# EAGLE design untitled (EAGLE 9.5.1)
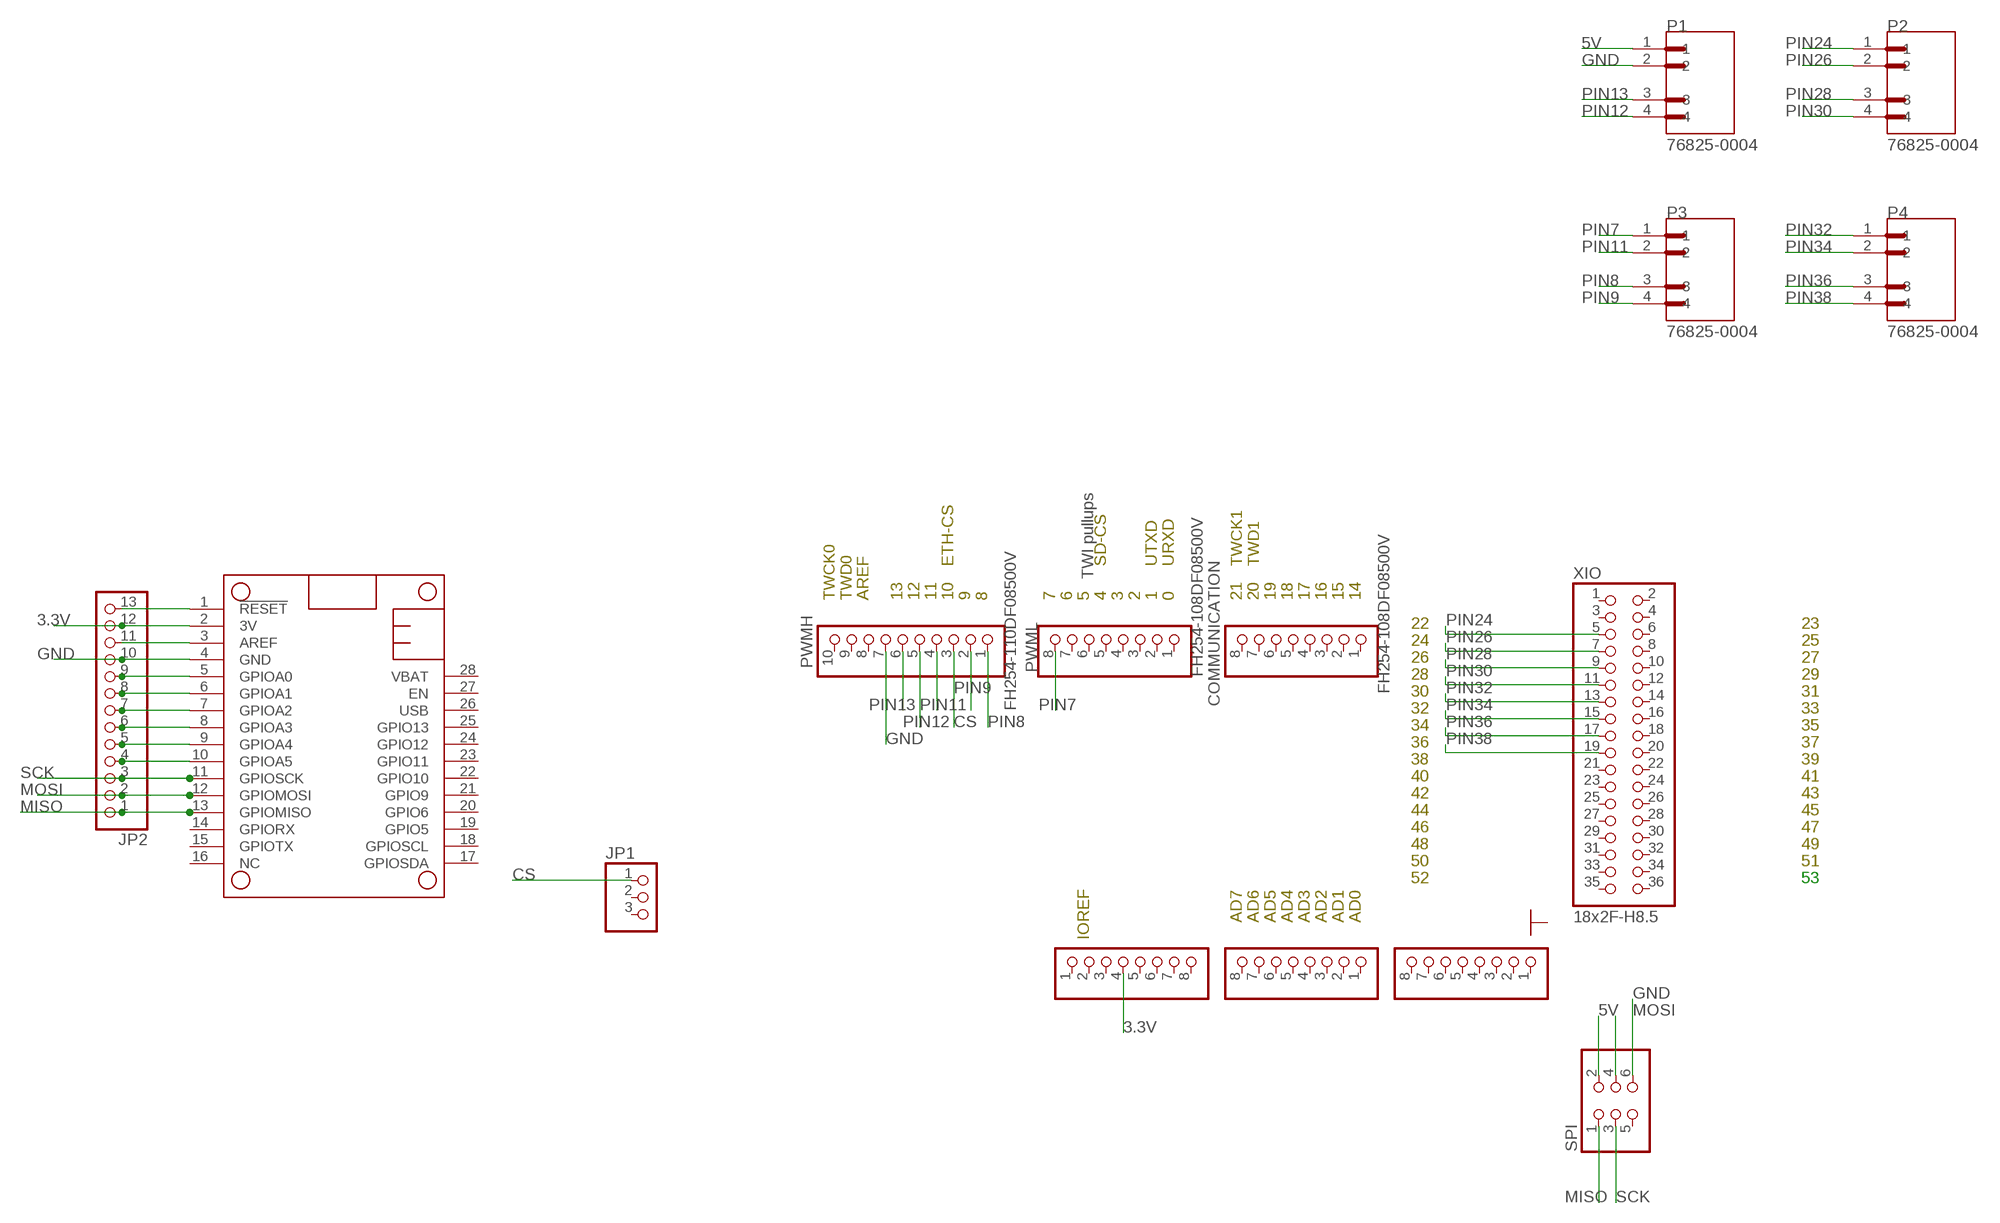
[diagram p0: schematic, sheet 1]

## Parts
ADCH  FH254-108DF08500V  1683_20TW-536  [1X08]
ADCL  FH254-108DF08500V  1683_20TW-536  [1X08]
COMMUNICATION  FH254-108DF08500V  1683_20TW-536  [1X08]
JP1  HEADER-1X376MIL  [1X03_ROUND_76]
JP2  HEADER-1X13  [1X13_ROUND_70]
MS1  FEATHERWING_NODIM  [FEATHERWING_NODIM]
P1  76825-0004  [MOLEX_76825-0004]
P2  76825-0004  [MOLEX_76825-0004]
P3  76825-0004  [MOLEX_76825-0004]
P4  76825-0004  [MOLEX_76825-0004]
POWER  FH254-108DF08500V  1683_20TW-536  [1X08]
PWMH  FH254-110DF08500V  1684_20TW-537  [1X10]
PWML  FH254-108DF08500V  1683_20TW-536  [1X08]
SPI  ICSP  0114_PH254-203DF118A00V  [2X03]
XIO  18x2F-H8.5  1756_12TW323  [2X18]

## Nets
3.3V: JP2.11 JP2.12 MS1.2(3V) MS1.3(AREF) POWER.4
5V: P1.1 SPI.2
CS: JP1.1 PWMH.3
GND: JP2.10 MS1.4(GND) P1.2 PWMH.7 SPI.6
MISO: JP2.1 MS1.13(GPIOMISO) SPI.1
MOSI: JP2.2 MS1.12(GPIOMOSI) SPI.4
N$22: JP2.13 MS1.1(!RESET)
N$28: JP2.4 MS1.10(GPIOA5)
N$29: JP2.5 MS1.9(GPIOA4)
N$30: JP2.6 MS1.8(GPIOA3)
N$31: JP2.7 MS1.7(GPIOA2)
N$32: JP2.8 MS1.6(GPIOA1)
N$33: JP2.9 MS1.5(GPIOA0)
PIN7: P3.1 PWML.8
PIN8: P3.3 PWMH.1
PIN9: P3.4 PWMH.2
PIN11: P3.2 PWMH.4
PIN12: P1.4 PWMH.5
PIN13: P1.3 PWMH.6
PIN24: P2.1 XIO.5
PIN26: P2.2 XIO.7
PIN28: P2.3 XIO.9
PIN30: P2.4 XIO.11
PIN32: P4.1 XIO.13
PIN34: P4.2 XIO.15
PIN36: P4.3 XIO.17
PIN38: P4.4 XIO.19
SCK: JP2.3 MS1.11(GPIOSCK) SPI.3
Unconnected: ADCH.1 ADCH.2 ADCH.3 ADCH.4 ADCH.5 ADCH.6 ADCH.7 ADCH.8 ADCL.1 ADCL.2 ADCL.3 ADCL.4 ADCL.5 ADCL.6 ADCL.7 ADCL.8 COMMUNICATION.1 COMMUNICATION.2 COMMUNICATION.3 COMMUNICATION.4 COMMUNICATION.5 COMMUNICATION.6 COMMUNICATION.7 COMMUNICATION.8 JP1.2 JP1.3 MS1.14(GPIORX) MS1.15(GPIOTX) MS1.16(NC) MS1.17(GPIOSDA) MS1.18(GPIOSCL) MS1.19(GPIO5) MS1.20(GPIO6) MS1.21(GPIO9) MS1.22(GPIO10) MS1.23(GPIO11) MS1.24(GPIO12) MS1.25(GPIO13) MS1.26(USB) MS1.27(EN) MS1.28(VBAT) POWER.1 POWER.2 POWER.3 POWER.5 POWER.6 POWER.7 POWER.8 PWMH.8 PWMH.9 PWMH.10 PWML.1 PWML.2 PWML.3 PWML.4 PWML.5 PWML.6 PWML.7 SPI.5 XIO.1 XIO.2 XIO.3 XIO.4 XIO.6 XIO.8 XIO.10 XIO.12 XIO.14 XIO.16 XIO.18 XIO.20 XIO.21 XIO.22 XIO.23 XIO.24 XIO.25 XIO.26 XIO.27 XIO.28 XIO.29 XIO.30 XIO.31 XIO.32 XIO.33 XIO.34 XIO.35 XIO.36

## Notes on the sheet
- ETH-CS | SD-CS | UTXD | URXD | TWCK1 | TWD1
- TWI pullups
- TWCK0 | TWD0 | AREF | 13 | 12 | 11 | 10 | 9 | 8 | 7 | 6 | 5 | 4 | 3 | 2 | 1 | 0 | 21 | 20 | 19 | 18 | 17 | 16 | 15 | 14
- 22 | 23
- 24 | 25
- 26 | 27
- 28 | 29
- 30 | 31
- 32 | 33
- 34 | 35
- 36 | 37
- 38 | 39
- 40 | 41
- 42 | 43
- 44 | 45
- 46 | 47
- 48 | 49
- 50 | 51
- 52 | 53
- AD7 | AD6 | AD5 | AD4 | AD3 | AD2 | AD1 | AD0
- IOREF

## Library data of the parts
ADCH ADCL COMMUNICATION POWER PWML = Connettori:1683_20TW-536: Female Gray Connector strip for Arduino 3V3 bases - 8x1 F V h 8,5 p2,54mm; MONTHLY_USAGE: _____; PART_NUMBER: 20TW-536; PRICE: _____; SUPPLIER: _____; TYPE: Connettori
JP1 = microbuilder:HEADER-1X3: PIN HEADER
JP2 = microbuilder:HEADER-1X13
MS1 = microbuilder:FEATHERWING
P1-P4 = 76825-0004:76825-0004: Conn Power HDR 4 POS 5.7mm Solder RA Thru-Hole 4 Terminal 1 Port Tray Mega-Fit; AVAILABILITY: Unavailable; DESCRIPTION: Connector Header Through Hole, Right Angle 4 position 0.224 _5.70mm_; MF: Molex; MP: 768250004; PACKAGE: None; PRICE: None
PWMH = Connettori:1684_20TW-537: Female Gray Connector strip for Arduino 3V3 bases - 10x1 F V h 8,5 p2,54mm; MONTHLY_USAGE: _____; PART_NUMBER: 20TW-537; PRICE: _____; SUPPLIER: _____; TYPE: Connettori
SPI = Connettori:0114_PH254-203DF118A00V: 3x2 M V h 8,5 mm p2,54; MONTHLY_USAGE: _____; PART_NUMBER: PH254-203DF118A00V; PRICE: _____; SUPPLIER: _____; TYPE: Connettori
XIO = Connettori:1756_12TW323: Female Gray Connector strip for Arduino 3V3 bases 18x2 F V h 8,5 p2,54; MONTHLY_USAGE: _____; PART_NUMBER: 12TW323; PRICE: _____; SUPPLIER: _____; TYPE: Connettori

## Board
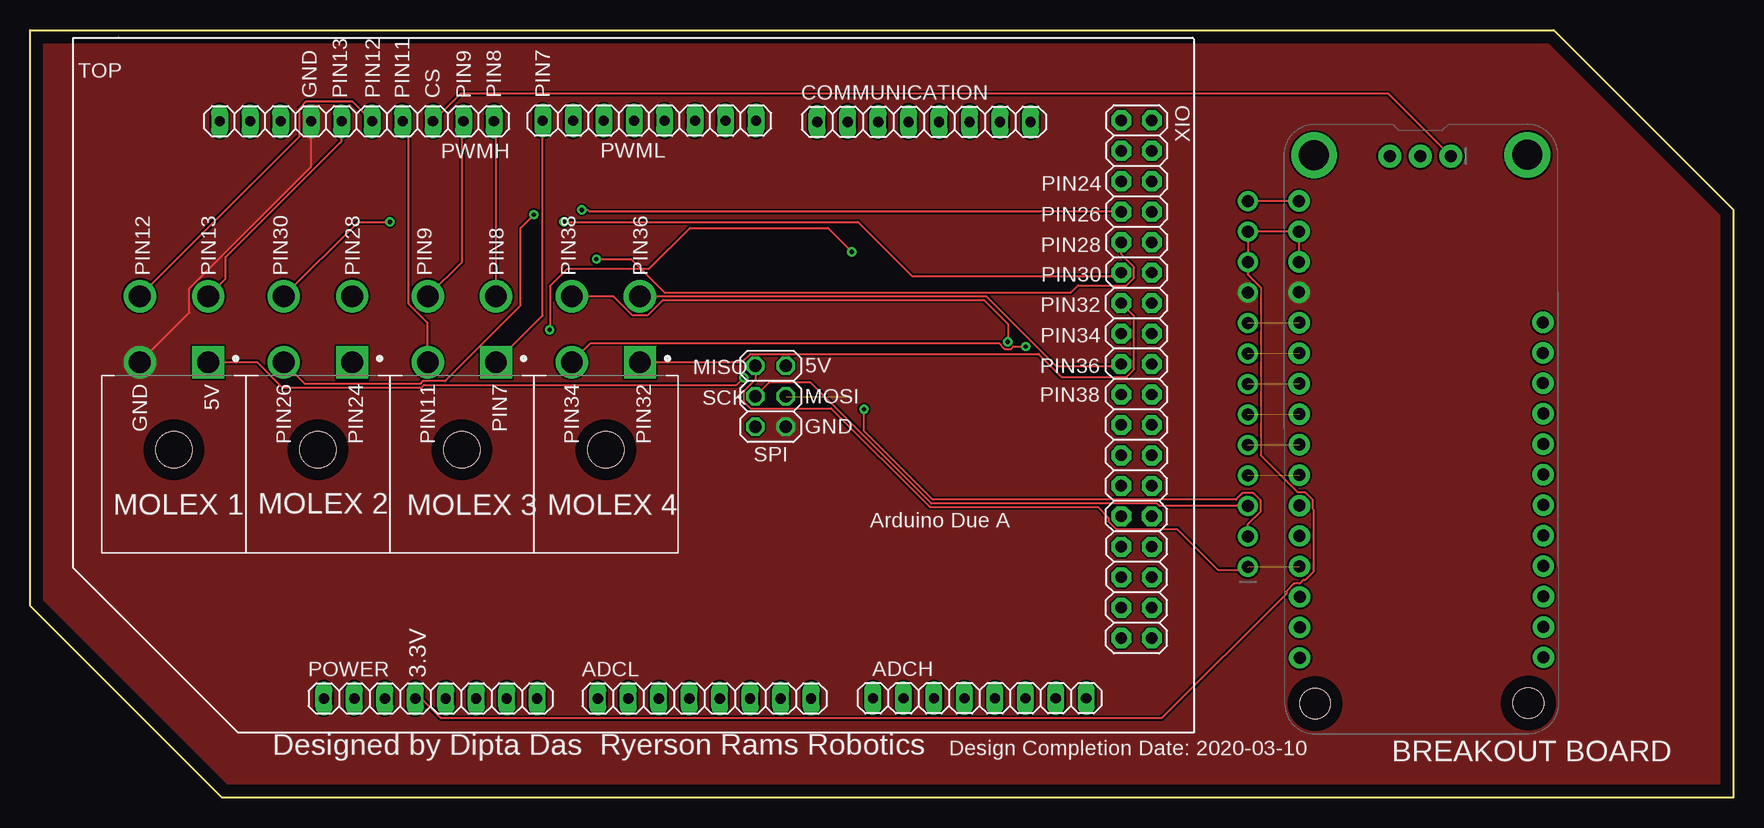
[diagram p1: board, top side]
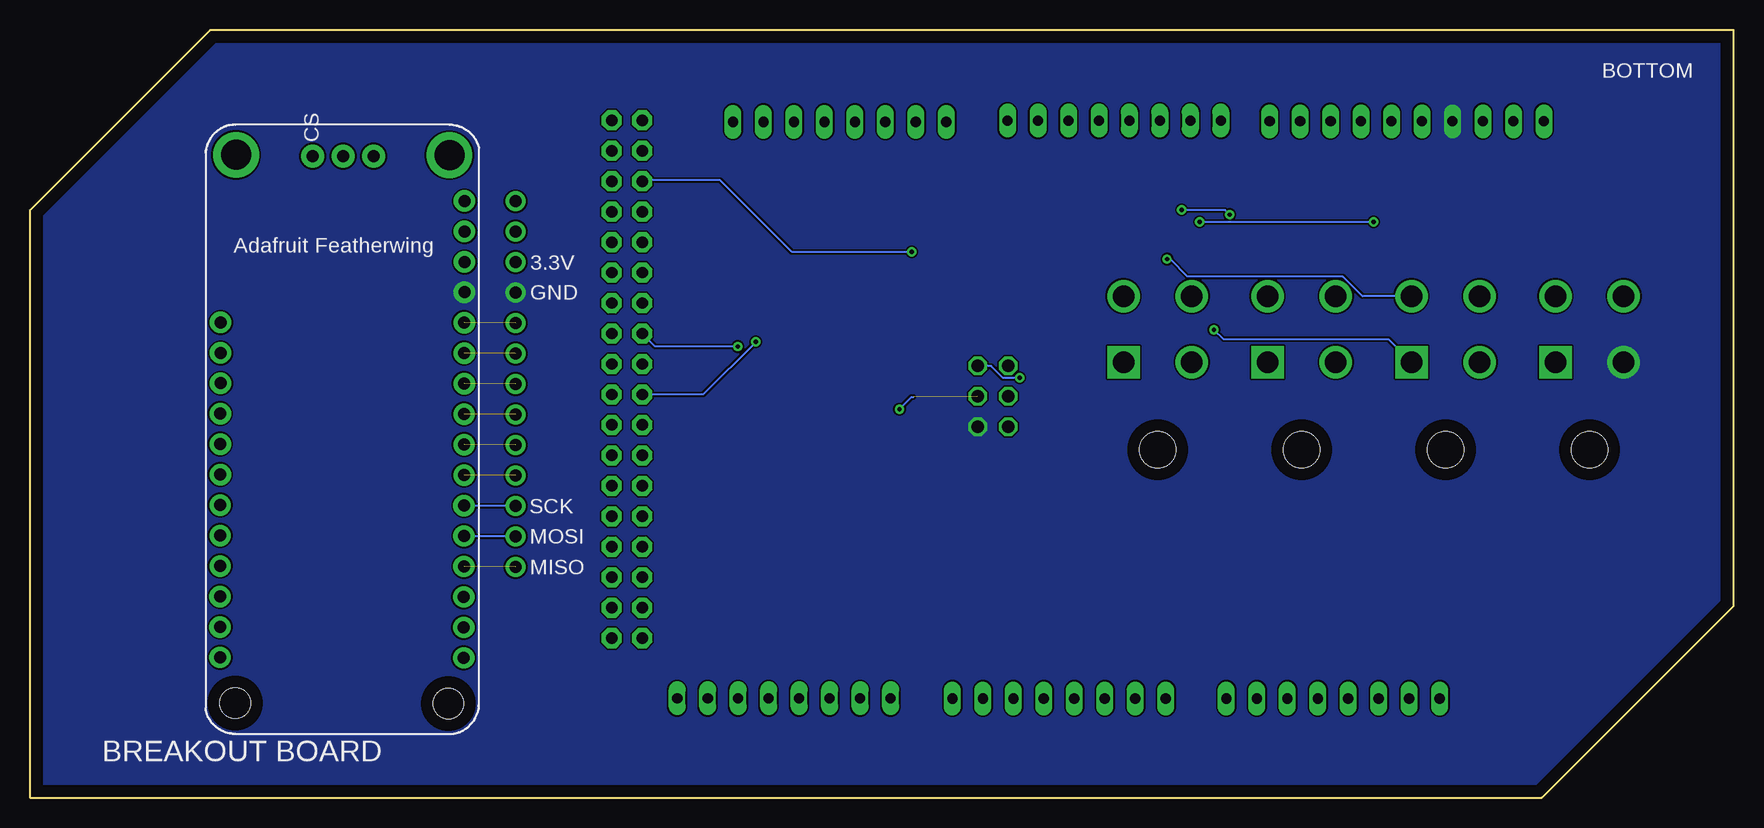
[diagram p2: board, bottom side, seen from below]

Size 142 x 64 mm. Coordinates in mm from the lower left corner, seen from the top.
Outline: 142,0 16,0 0,16 0,64 127,64 142,49 142,0
Copper layers (1*16): Top 0.035mm / dielectric 1.5mm / Bottom 0.035mm
Design rules "default": minimum track width 6mil, minimum drill 0.35mm, track to track 6mil, track to pad 6mil, pad to pad 6mil, via to via 6mil, smd to smd 6mil, copper to edge 40mil, drill to drill 6mil, minimum pad ring 10mil, minimum via ring 8mil, stop-mask expansion 4mil, vias tented up to drill 0mil, thermal gap 10mil

### Footprints (pad centres in the part's own frame; a part is rotated, then mirrored left to right if it is on the bottom)
1X08 = drill 0.85 pad 1.422 long: 1 -8.89,0; 2 -6.35,0; 3 -3.81,0; 4 -1.27,0; 5 1.27,0; 6 3.81,0; 7 6.35,0; 8 8.89,0
1X03_ROUND_76 = drill 1 pad 1.93: 1 -2.54,0; 2 0,0; 3 2.54,0
1X13_ROUND_70 = drill 1 pad 1.676: 1 -15.24,0; 2 -12.7,0; 3 -10.16,0; 4 -7.62,0; 5 -5.08,0; 6 -2.54,0; 7 0,0; 8 2.54,0; 9 5.08,0; 10 7.62,0; 11 10.16,0; 12 12.7,0; 13 15.24,0
FEATHERWING_NODIM = drill 1 pad 1.778: 1 6.35,1.27; 2 8.89,1.27; 3 11.43,1.27; 4 13.97,1.27; 5 16.51,1.27; 6 19.05,1.27; 7 21.59,1.27; 8 24.13,1.27; 9 26.67,1.27; 10 29.21,1.27; 11 31.75,1.27; 12 34.29,1.27; 13 36.83,1.27; 14 39.37,1.27; 15 41.91,1.27; 16 44.45,1.27; 17 44.45,21.59; 18 41.91,21.59; 19 39.37,21.59; 20 36.83,21.59; 21 34.29,21.59; 22 31.75,21.59; 23 29.21,21.59; 24 26.67,21.59; 25 24.13,21.59; 26 21.59,21.59; 27 19.05,21.59; 28 16.51,21.59 | drill 2.5 pad 3.81: P$1 2.54,20.32; P$2 2.54,2.54 | hole 2.54: 48.26,20.32; 48.26,2.54
MOLEX_76825-0004 = drill 1.8 square: 1 2.85,7.3 | drill 1.8: 2 -2.85,7.3; 3 2.85,12.8; 4 -2.85,12.8 | hole 3: 0,0
1X10 = drill 0.85 pad 1.422 long: 1 -11.43,0; 2 -8.89,0; 3 -6.35,0; 4 -3.81,0; 5 -1.27,0; 6 1.27,0; 7 3.81,0; 8 6.35,0; 9 8.89,0; 10 11.43,0
2X03 = drill 1.016 pad 1.55 octagon: 1 -2.54,-1.27; 2 -2.54,1.27; 3 0,-1.27; 4 0,1.27; 5 2.54,-1.27; 6 2.54,1.27
2X18 = drill 0.95 pad 1.676 octagon: 1 -21.59,-1.27; 2 -21.59,1.27; 3 -19.05,-1.27; 4 -19.05,1.27; 5 -16.51,-1.27; 6 -16.51,1.27; 7 -13.97,-1.27; 8 -13.97,1.27; 9 -11.43,-1.27; 10 -11.43,1.27; 11 -8.89,-1.27; 12 -8.89,1.27; 13 -6.35,-1.27; 14 -6.35,1.27; 15 -3.81,-1.27; 16 -3.81,1.27; 17 -1.27,-1.27; 18 -1.27,1.27; 19 1.27,-1.27; 20 1.27,1.27; 21 3.81,-1.27; 22 3.81,1.27; 23 6.35,-1.27; 24 6.35,1.27; 25 8.89,-1.27; 26 8.89,1.27; 27 11.43,-1.27; 28 11.43,1.27; 29 13.97,-1.27; 30 13.97,1.27; 31 16.51,-1.27; 32 16.51,1.27; 33 19.05,-1.27; 34 19.05,1.27; 35 21.59,-1.27; 36 21.59,1.27

### Placement (x,y rotation side)
ADCH  79.16,8.28 0 top
ADCL  56.22,8.26 0 top
COMMUNICATION  74.51,56.34 0 top
JP1  115.89,53.49 180 top
JP2  101.52,34.48 90 top
MS1  104.5,56.09 270.1 top
P1  12,29 0 top
P2  24,29 0 top
P3  36,29 0 top
P4  48,29 0 top
POWER  33.39,8.26 0 top
PWMH  27.24,56.39 180 top
PWML  51.62,56.44 180 top
SPI  61.73,33.45 270 top
XIO  92.24,34.88 270 top

### Tracks (layer width: path | path; a pad name or v marks a point on that pad's centre or on a via)
3.3V
  Top 0.152: MS1.3 MS1.2 101.55,47.21 JP2.12 JP2.11 101.52,43.6 102.59,42.54 102.59,28.54 105.66,25.46 106.29,25.46 106.94,24.81 106.94,24.06 107,24 107,18.85 106.3,18.15 106.15,18.15 105.84,17.84 105.37,17.84 104.72,17.19 104.72,17 94.32,6.61 34.27,6.61 32.62,8.26 POWER.4
5V  (via drill 0.35)
  Top 0.152: P1.1 18.92,36.3 21.02,34.2 32.63,34.2 32.85,34.42 58.92,34.42 v59.5,35
  Bottom 0.152: v59.5,35 60.04,35 60.05,34.99 60.88,34.99 61.88,35.99 SPI.2
CS
  Top 0.152: JP1.1 113.22,58.69 35.89,58.69 PWMH.3
GND
  Top 0.152: P1.2 13.27,40.42 13.27,42.45 23.43,52.61 PWMH.7
  pour Top (no thermals): -2,66.5 0,68.5 141,68.5 156.5,53 156.5,15.5 156.5,5.5 141,-10 16.5,-10 13.5,-7 -6.5,13 -6.5,33 -6.5,62
  pour Bottom (no thermals): -2.5,68.5 130.5,68.5 150,49 149.5,48.5 149.5,-6 10,-6 0.5,3.5 -2.5,6.5
MISO  (1 unrouted)
  Top 0.152: SPI.1 60.46,34.87 59.46,33.87 59.46,33.04 60.05,32.45 66.78,32.45 75.02,24.21 89,24.21 89.9,23.31 89.9,23 90.53,22.38 95.62,22.38 99,19 101.28,19 JP2.1
MOSI  (via drill 0.35)  (1 unrouted)
  Top 0.152: JP2.2 101.52,22.81 102.59,23.88 102.59,24.76 101.96,25.38 101.08,25.38 100.54,24.84 75.25,24.84 69.52,30.57 69.52,32.38 v69.53,32.38
  Bottom 0.152: v69.53,32.38 68.51,33.39 68.38,33.39 | JP2.2 105.8,21.78 MS1.12
N$22
  Top 0.152: MS1.1 101.55,49.75 JP2.13
N$28  (1 unrouted)
N$29  (1 unrouted)
N$30  (1 unrouted)
N$31  (1 unrouted)
N$32  (1 unrouted)
N$33  (1 unrouted)
PIN7
  Top 0.152: P3.1 42.73,40.19 PWML.8
PIN8
  Top 0.152: P3.3 38.85,56.21 PWMH.1
PIN9
  Top 0.152: P3.4 36,44.65 36,56.26 PWMH.2
PIN11
  Top 0.152: P3.2 33.15,39.57 31.57,41.15 31.57,55.87 PWMH.4
PIN12
  Top 0.152: P1.4 22.49,55.14 22.49,57.49 23.04,58.04 23.89,58.04 23.9,58.05 26.85,58.05 PWMH.5
PIN13
  Top 0.152: P1.3 16.31,43.26 16.31,45.06 25.97,54.72 PWMH.6
PIN24  (via drill 0.35)
  Top 0.152: v43.3,39 43.35,39.05 43.35,42.64 44.82,44.11 51.61,44.11 55,47.5 66.5,47.5 v68.5,45.5
  Bottom 0.152: P2.1 28.76,38.21 42.52,38.21 v43.3,39 | XIO.5 90.86,51.5 84.5,51.5 78.5,45.5 v68.5,45.5
PIN26  (via drill 0.35)
  Top 0.152: XIO.7 46.65,48.85 46.5,49 v46,49 | 40.89,41.63 40.9,41.64 | P2.2 22.95,34.5 32.5,34.5 32.72,34.72 34.61,34.72 40.89,41 40.89,41.63 | 40.89,41.63 40.89,47.5 v42,48.61
  Bottom 0.152: v42,48.61 42.39,49 v46,49
PIN28  (via drill 0.35)
  Top 0.152: v47.21,44.9 50.1,44.9 52.89,42.1 86.77,42.1 87.36,42.7 91.41,42.7 92.04,43.33 92.04,44.21 90.97,45.28 XIO.9
  Bottom 0.152: P2.3 30.92,41.8 32.57,43.45 45.5,43.45 46.95,44.9 v47.21,44.9
PIN30  (via drill 0.35)
  Top 0.152: P2.4 27.35,48 v30,48 | v44.5,48 69,48 73.5,43.5 90.7,43.5 XIO.11
  Bottom 0.152: v30,48 v44.5,48
PIN32
  Top 0.152: P4.1 59.35,36.3 60.05,37 84.07,37 85.99,35.08 91.41,35.08 92.04,35.7 92.04,36.59 92,36.62 92,38.21 92.04,38.24 92.04,40.16 XIO.13
PIN34  (via drill 0.35)
  Top 0.152: v83,37.6 81.96,37.6 81.75,37.39 81.25,37.39 80.76,37.88 46.73,37.88 P4.2
  Bottom 0.152: v83,37.6 89.89,37.6 XIO.15
PIN36
  Top 0.152: P4.3 79.7,41.8 85.5,36 90.82,36 XIO.17
PIN38  (via drill 0.35)
  Top 0.152: P4.4 48.62,41.8 50.2,40.22 51.5,40.22 52.78,41.49 79.5,41.49 81.5,39.49 v81.5,38
  Bottom 0.152: v81.5,38 85.89,33.61 XIO.19
SCK
  Top 0.152: JP2.3 94.15,24.32 93.95,24.51 75.14,24.51 65.07,34.59 61.59,34.59 SPI.3
  Bottom 0.152: JP2.3 105.79,24.32 MS1.11

### Text on the board
tNames: TOP | GND | PIN13 | PIN12 | PIN11 | CS | PIN9 | PIN8 | PIN7 | PIN24 | PIN26 | PIN28 | PIN12 | PIN13 | PIN30 | PIN28 | PIN9 | PIN8 | PIN38 | PIN36 | PIN30 | PIN32 | PIN34 | GND | 5V | PIN26 | PIN24 | PIN11 | PIN7 | PIN34 | PIN32 | MISO | 5V | PIN36 | SCK | MOSI | PIN38 | GND | SPI | MOLEX 1 | MOLEX 2 | MOLEX 3 | MOLEX 4 | Arduino Due A | 3.3V | Designed by Dipta Das | Ryerson Rams Robotics | Design Completion Date: 2020-03-10 | BREAKOUT BOARD
bNames: BOTTOM | CS | Adafruit Featherwing | 3.3V | GND | SCK | MOSI | MISO | BREAKOUT BOARD